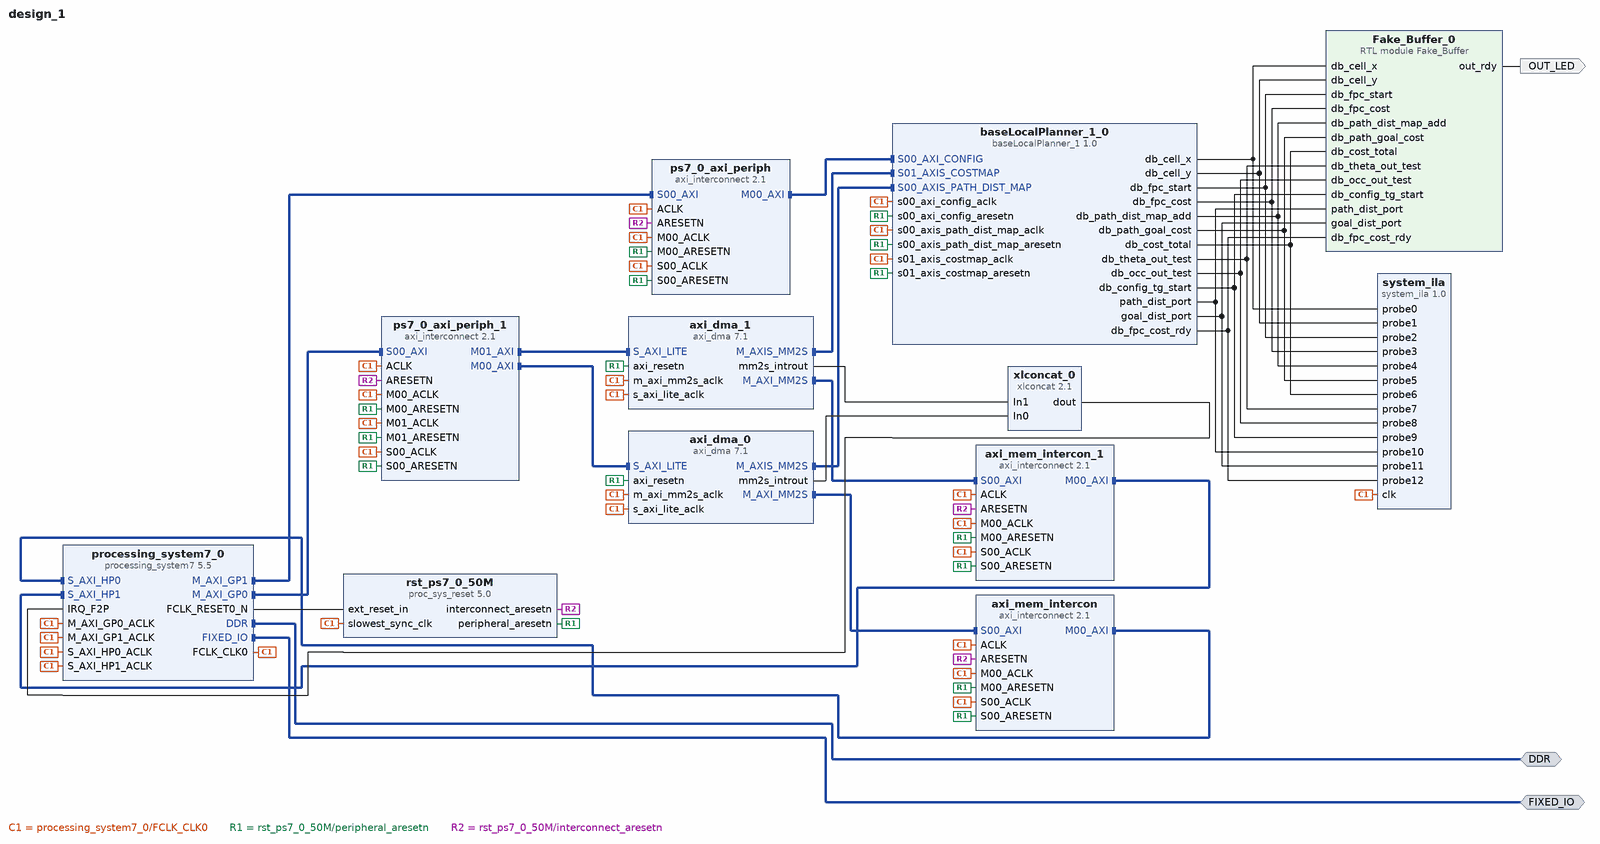
[diagram p0: block diagram of the top level]
# Vivado block design design_1, xc7z020clg484-1, Vivado 2016.4
create_bd_design design_1

create_bd_intf_port -mode Master -vlnv xilinx.com:interface:ddrx_rtl:1.0 DDR
create_bd_intf_port -mode Master -vlnv xilinx.com:display_processing_system7:fixedio_rtl:1.0 FIXED_IO
create_bd_port -dir O OUT_LED

create_bd_cell -type ip -vlnv xilinx.com:ip:processing_system7:5.5 processing_system7_0
set_property -dict [list \
  CONFIG.PCW_FPGA0_PERIPHERAL_FREQMHZ 25 \
  CONFIG.PCW_USE_M_AXI_GP1 1 \
  CONFIG.PCW_USE_S_AXI_HP0 1 \
  CONFIG.PCW_USE_S_AXI_HP1 1 \
  CONFIG.PCW_USE_FABRIC_INTERRUPT 1 \
  CONFIG.PCW_IRQ_F2P_INTR 1 \
  CONFIG.PCW_QSPI_GRP_SINGLE_SS_ENABLE 1 \
  CONFIG.PCW_SD0_PERIPHERAL_ENABLE 0 \
  CONFIG.preset ZC702 \
] [get_bd_cells processing_system7_0]
# 2 more settings of processing_system7_0 are not shown: defaults, MIO pin electricals, DDR timing, and values the tool derives
create_bd_cell -type ip -vlnv xilinx.com:ip:axi_dma:7.1 axi_dma_0
set_property -dict {CONFIG.c_include_sg 0 CONFIG.c_mm2s_burst_size 64 CONFIG.c_include_s2mm 0} [get_bd_cells axi_dma_0]
create_bd_cell -type ip -vlnv xilinx.com:ip:axi_dma:7.1 axi_dma_1
set_property -dict {CONFIG.c_include_sg 0 CONFIG.c_mm2s_burst_size 64 CONFIG.c_include_s2mm 0} [get_bd_cells axi_dma_1]
create_bd_cell -type ip -vlnv xilinx.com:ip:xlconcat:2.1 xlconcat_0
create_bd_cell -type ip -vlnv xilinx.com:ip:axi_interconnect:2.1 axi_mem_intercon
set_property -dict {CONFIG.NUM_MI 1} [get_bd_cells axi_mem_intercon]
create_bd_cell -type ip -vlnv xilinx.com:ip:proc_sys_reset:5.0 rst_ps7_0_50M
create_bd_cell -type ip -vlnv xilinx.com:ip:axi_interconnect:2.1 axi_mem_intercon_1
set_property -dict {CONFIG.NUM_MI 1} [get_bd_cells axi_mem_intercon_1]
create_bd_cell -type ip -vlnv xilinx.com:ip:axi_interconnect:2.1 ps7_0_axi_periph
set_property -dict {CONFIG.NUM_MI 1} [get_bd_cells ps7_0_axi_periph]
create_bd_cell -type ip -vlnv xilinx.com:ip:axi_interconnect:2.1 ps7_0_axi_periph_1
set_property -dict {CONFIG.NUM_MI 2} [get_bd_cells ps7_0_axi_periph_1]
create_bd_cell -type module -reference Fake_Buffer Fake_Buffer_0
create_bd_cell -type ip -vlnv xilinx.com:ip:system_ila:1.0 system_ila
set_property -dict [list \
  CONFIG.C_PROBE12_TYPE 0 \
  CONFIG.C_PROBE11_TYPE 0 \
  CONFIG.C_PROBE10_TYPE 0 \
  CONFIG.C_PROBE9_TYPE 0 \
  CONFIG.C_PROBE8_TYPE 0 \
  CONFIG.C_PROBE7_TYPE 0 \
  CONFIG.C_PROBE6_TYPE 0 \
  CONFIG.C_PROBE5_TYPE 0 \
  CONFIG.C_PROBE4_TYPE 0 \
  CONFIG.C_PROBE3_TYPE 0 \
  CONFIG.C_PROBE2_TYPE 0 \
  CONFIG.C_PROBE1_TYPE 0 \
  CONFIG.C_PROBE0_TYPE 0 \
  CONFIG.C_NUM_OF_PROBES 13 \
  CONFIG.C_MON_TYPE NATIVE \
] [get_bd_cells system_ila]
create_bd_cell -type ip -vlnv xilinx.com:user:baseLocalPlanner_1:1.0 baseLocalPlanner_1_0

# ---- connections ----

connect_bd_intf_net [get_bd_intf_pins axi_dma_0/M_AXI_MM2S] [get_bd_intf_pins axi_mem_intercon/S00_AXI]
connect_bd_intf_net [get_bd_intf_pins axi_mem_intercon/M00_AXI] [get_bd_intf_pins processing_system7_0/S_AXI_HP0]
connect_bd_intf_net [get_bd_intf_pins axi_dma_1/M_AXI_MM2S] [get_bd_intf_pins axi_mem_intercon_1/S00_AXI]
connect_bd_intf_net [get_bd_intf_pins axi_mem_intercon_1/M00_AXI] [get_bd_intf_pins processing_system7_0/S_AXI_HP1]
connect_bd_intf_net [get_bd_intf_pins processing_system7_0/M_AXI_GP1] [get_bd_intf_pins ps7_0_axi_periph/S00_AXI]
connect_bd_intf_net [get_bd_intf_pins ps7_0_axi_periph/M00_AXI] [get_bd_intf_pins baseLocalPlanner_1_0/S00_AXI_CONFIG]
connect_bd_intf_net [get_bd_intf_pins processing_system7_0/M_AXI_GP0] [get_bd_intf_pins ps7_0_axi_periph_1/S00_AXI]
connect_bd_intf_net [get_bd_intf_pins ps7_0_axi_periph_1/M00_AXI] [get_bd_intf_pins axi_dma_0/S_AXI_LITE]
connect_bd_intf_net [get_bd_intf_pins ps7_0_axi_periph_1/M01_AXI] [get_bd_intf_pins axi_dma_1/S_AXI_LITE]
connect_bd_intf_net [get_bd_intf_pins axi_dma_1/M_AXIS_MM2S] [get_bd_intf_pins baseLocalPlanner_1_0/S01_AXIS_COSTMAP]
connect_bd_intf_net [get_bd_intf_pins baseLocalPlanner_1_0/S00_AXIS_PATH_DIST_MAP] [get_bd_intf_pins axi_dma_0/M_AXIS_MM2S]
connect_bd_intf_net [get_bd_intf_ports DDR] [get_bd_intf_pins processing_system7_0/DDR]
connect_bd_intf_net [get_bd_intf_ports FIXED_IO] [get_bd_intf_pins processing_system7_0/FIXED_IO]
connect_bd_net [get_bd_pins processing_system7_0/FCLK_CLK0] \
  [get_bd_pins axi_dma_0/m_axi_mm2s_aclk] [get_bd_pins rst_ps7_0_50M/slowest_sync_clk] \
  [get_bd_pins processing_system7_0/S_AXI_HP0_ACLK] [get_bd_pins axi_dma_1/m_axi_mm2s_aclk] \
  [get_bd_pins processing_system7_0/S_AXI_HP1_ACLK] [get_bd_pins processing_system7_0/M_AXI_GP1_ACLK] \
  [get_bd_pins processing_system7_0/M_AXI_GP0_ACLK] [get_bd_pins axi_dma_0/s_axi_lite_aclk] \
  [get_bd_pins axi_dma_1/s_axi_lite_aclk] [get_bd_pins system_ila/clk] [get_bd_pins axi_mem_intercon/S00_ACLK] \
  [get_bd_pins axi_mem_intercon/ACLK] [get_bd_pins axi_mem_intercon/M00_ACLK] [get_bd_pins axi_mem_intercon_1/S00_ACLK] \
  [get_bd_pins axi_mem_intercon_1/ACLK] [get_bd_pins axi_mem_intercon_1/M00_ACLK] [get_bd_pins ps7_0_axi_periph/S00_ACLK] \
  [get_bd_pins ps7_0_axi_periph/ACLK] [get_bd_pins ps7_0_axi_periph/M00_ACLK] [get_bd_pins ps7_0_axi_periph_1/S00_ACLK] \
  [get_bd_pins ps7_0_axi_periph_1/ACLK] [get_bd_pins ps7_0_axi_periph_1/M00_ACLK] [get_bd_pins ps7_0_axi_periph_1/M01_ACLK] \
  [get_bd_pins baseLocalPlanner_1_0/s00_axi_config_aclk] [get_bd_pins baseLocalPlanner_1_0/s01_axis_costmap_aclk] \
  [get_bd_pins baseLocalPlanner_1_0/s00_axis_path_dist_map_aclk]
connect_bd_net [get_bd_pins processing_system7_0/FCLK_RESET0_N] [get_bd_pins rst_ps7_0_50M/ext_reset_in]
connect_bd_net [get_bd_pins rst_ps7_0_50M/peripheral_aresetn] \
  [get_bd_pins axi_dma_0/axi_resetn] [get_bd_pins axi_dma_1/axi_resetn] [get_bd_pins axi_mem_intercon/S00_ARESETN] \
  [get_bd_pins axi_mem_intercon/M00_ARESETN] [get_bd_pins axi_mem_intercon_1/S00_ARESETN] \
  [get_bd_pins axi_mem_intercon_1/M00_ARESETN] [get_bd_pins ps7_0_axi_periph/S00_ARESETN] \
  [get_bd_pins ps7_0_axi_periph/M00_ARESETN] [get_bd_pins ps7_0_axi_periph_1/S00_ARESETN] \
  [get_bd_pins ps7_0_axi_periph_1/M00_ARESETN] [get_bd_pins ps7_0_axi_periph_1/M01_ARESETN] \
  [get_bd_pins baseLocalPlanner_1_0/s00_axi_config_aresetn] [get_bd_pins baseLocalPlanner_1_0/s01_axis_costmap_aresetn] \
  [get_bd_pins baseLocalPlanner_1_0/s00_axis_path_dist_map_aresetn]
connect_bd_net [get_bd_pins rst_ps7_0_50M/interconnect_aresetn] \
  [get_bd_pins axi_mem_intercon/ARESETN] [get_bd_pins axi_mem_intercon_1/ARESETN] [get_bd_pins ps7_0_axi_periph/ARESETN] \
  [get_bd_pins ps7_0_axi_periph_1/ARESETN]
connect_bd_net [get_bd_pins axi_dma_1/mm2s_introut] [get_bd_pins xlconcat_0/In1]
connect_bd_net [get_bd_pins axi_dma_0/mm2s_introut] [get_bd_pins xlconcat_0/In0]
connect_bd_net [get_bd_pins xlconcat_0/dout] [get_bd_pins processing_system7_0/IRQ_F2P]
connect_bd_net [get_bd_pins baseLocalPlanner_1_0/db_cell_x] [get_bd_pins Fake_Buffer_0/db_cell_x] [get_bd_pins system_ila/probe0]
connect_bd_net [get_bd_pins baseLocalPlanner_1_0/db_cell_y] [get_bd_pins Fake_Buffer_0/db_cell_y] [get_bd_pins system_ila/probe1]
connect_bd_net [get_bd_pins baseLocalPlanner_1_0/db_fpc_start] [get_bd_pins Fake_Buffer_0/db_fpc_start] [get_bd_pins system_ila/probe2]
connect_bd_net [get_bd_pins baseLocalPlanner_1_0/db_fpc_cost] [get_bd_pins Fake_Buffer_0/db_fpc_cost] [get_bd_pins system_ila/probe3]
connect_bd_net [get_bd_pins baseLocalPlanner_1_0/db_path_dist_map_add] \
  [get_bd_pins Fake_Buffer_0/db_path_dist_map_add] [get_bd_pins system_ila/probe4]
connect_bd_net [get_bd_pins baseLocalPlanner_1_0/db_path_goal_cost] [get_bd_pins Fake_Buffer_0/db_path_goal_cost] [get_bd_pins system_ila/probe5]
connect_bd_net [get_bd_pins baseLocalPlanner_1_0/db_cost_total] [get_bd_pins Fake_Buffer_0/db_cost_total] [get_bd_pins system_ila/probe6]
connect_bd_net [get_bd_pins baseLocalPlanner_1_0/db_theta_out_test] [get_bd_pins Fake_Buffer_0/db_theta_out_test] [get_bd_pins system_ila/probe7]
connect_bd_net [get_bd_pins baseLocalPlanner_1_0/db_occ_out_test] [get_bd_pins Fake_Buffer_0/db_occ_out_test] [get_bd_pins system_ila/probe8]
connect_bd_net [get_bd_pins baseLocalPlanner_1_0/db_config_tg_start] [get_bd_pins Fake_Buffer_0/db_config_tg_start] [get_bd_pins system_ila/probe9]
connect_bd_net [get_bd_pins baseLocalPlanner_1_0/path_dist_port] [get_bd_pins Fake_Buffer_0/path_dist_port] [get_bd_pins system_ila/probe10]
connect_bd_net [get_bd_pins baseLocalPlanner_1_0/goal_dist_port] [get_bd_pins Fake_Buffer_0/goal_dist_port] [get_bd_pins system_ila/probe11]
connect_bd_net [get_bd_pins baseLocalPlanner_1_0/db_fpc_cost_rdy] [get_bd_pins Fake_Buffer_0/db_fpc_cost_rdy] [get_bd_pins system_ila/probe12]
connect_bd_net [get_bd_pins Fake_Buffer_0/out_rdy] [get_bd_ports OUT_LED]

# ---- address map ----
assign_bd_address -offset 0x00000000 -range 1G -target_address_space [get_bd_addr_spaces axi_dma_0/Data_MM2S] [get_bd_addr_segs processing_system7_0/S_AXI_HP0/HP0_DDR_LOWOCM]
assign_bd_address -offset 0x00000000 -range 1G -target_address_space [get_bd_addr_spaces axi_dma_1/Data_MM2S] [get_bd_addr_segs processing_system7_0/S_AXI_HP1/HP1_DDR_LOWOCM]
assign_bd_address -offset 0x40400000 -range 64K -target_address_space [get_bd_addr_spaces processing_system7_0/Data] [get_bd_addr_segs axi_dma_0/S_AXI_LITE/Reg]
assign_bd_address -offset 0x40410000 -range 64K -target_address_space [get_bd_addr_spaces processing_system7_0/Data] [get_bd_addr_segs axi_dma_1/S_AXI_LITE/Reg]
assign_bd_address -offset 0x83C00000 -range 64K -target_address_space [get_bd_addr_spaces processing_system7_0/Data] [get_bd_addr_segs baseLocalPlanner_1_0/S00_AXI_CONFIG/S00_AXI_CONFIG_reg]

validate_bd_design
save_bd_design
